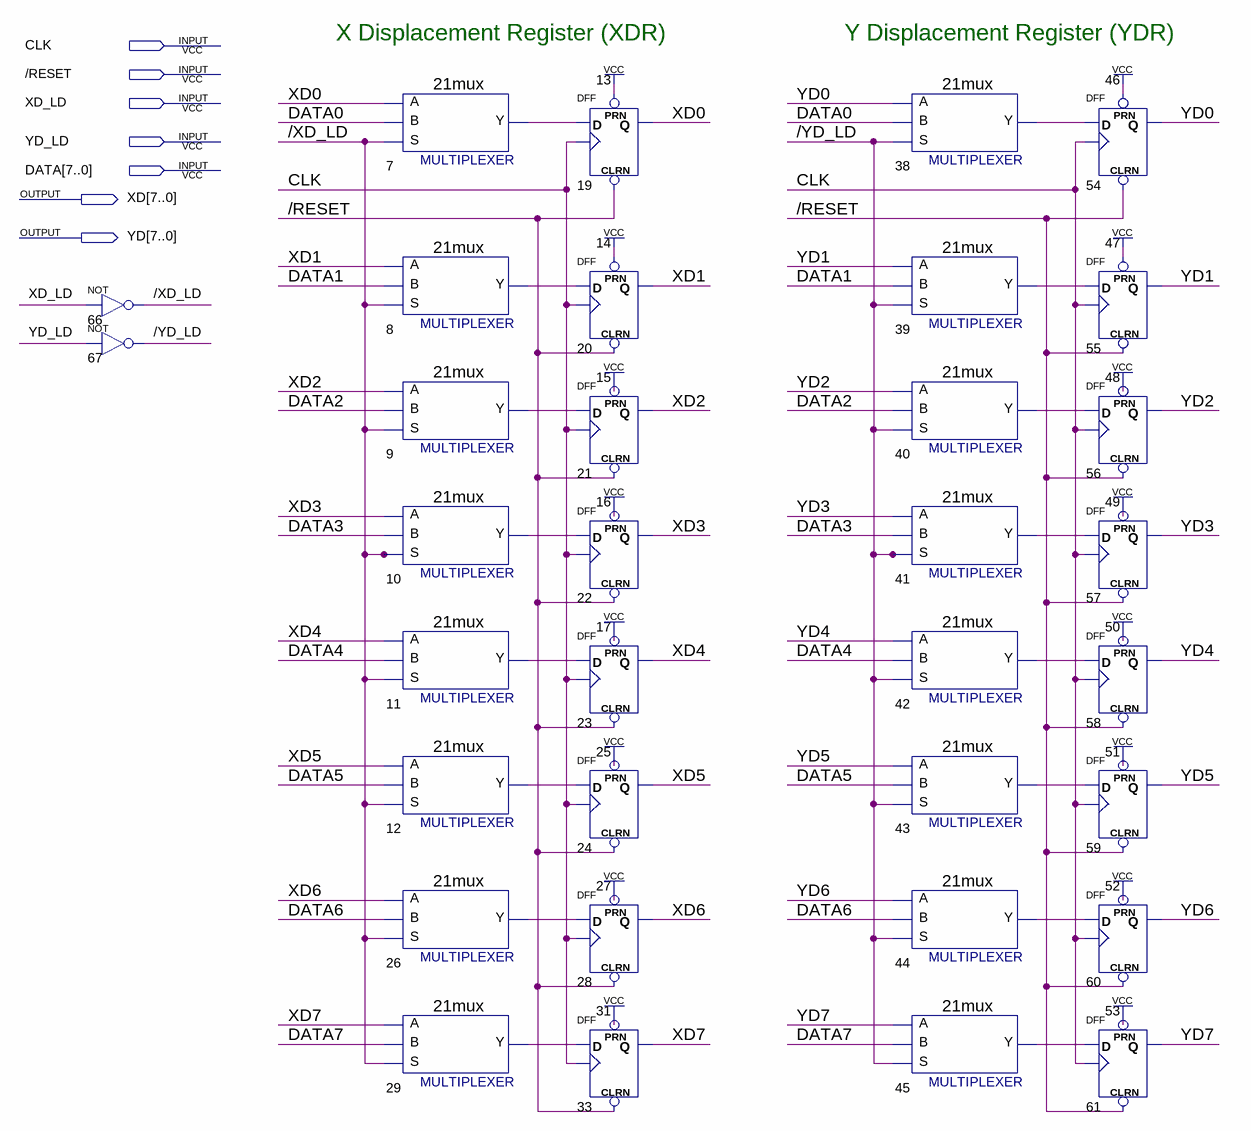
[diagram p0: schematic sheet]
// Quartus schematic xdr_ydr.bdf as structural Verilog: 34 symbols, 7 pins
module xdr_ydr (
  input  CLK,
  input  \/RESET ,
  input  XD_LD,
  input  YD_LD,
  input  [7:0] DATA,
  output [7:0] XD,
  output [7:0] YD
);

  wire \/XD_LD , \/YD_LD , n7_y, n8_y, n9_y, n10_y, n11_y, n12_y, n26_y, n29_y, n38_y, n39_y, n40_y, n41_y,
       n42_y, n43_y, n44_y, n45_y;

  not u_66 (\/XD_LD , XD_LD);
  not u_67 (\/YD_LD , YD_LD);
  \21mux  u_7 (.A(XD[0]), .B(DATA[0]), .S(\/XD_LD ), .Y(n7_y));
  \21mux  u_8 (.A(XD[1]), .B(DATA[1]), .S(\/XD_LD ), .Y(n8_y));
  \21mux  u_9 (.A(XD[2]), .B(DATA[2]), .S(\/XD_LD ), .Y(n9_y));
  \21mux  u_10 (.A(XD[3]), .B(DATA[3]), .S(\/XD_LD ), .Y(n10_y));
  \21mux  u_11 (.A(XD[4]), .B(DATA[4]), .S(\/XD_LD ), .Y(n11_y));
  \21mux  u_12 (.A(XD[5]), .B(DATA[5]), .S(\/XD_LD ), .Y(n12_y));
  \21mux  u_26 (.A(XD[6]), .B(DATA[6]), .S(\/XD_LD ), .Y(n26_y));
  \21mux  u_29 (.A(XD[7]), .B(DATA[7]), .S(\/XD_LD ), .Y(n29_y));
  DFF u_19 (.CLRN(\/RESET ), .CLK(CLK), .D(n7_y), .PRN(1'b1), .Q(XD[0]));
  DFF u_20 (.CLRN(\/RESET ), .CLK(CLK), .D(n8_y), .PRN(1'b1), .Q(XD[1]));
  DFF u_21 (.CLRN(\/RESET ), .CLK(CLK), .D(n9_y), .PRN(1'b1), .Q(XD[2]));
  DFF u_22 (.CLRN(\/RESET ), .CLK(CLK), .D(n10_y), .PRN(1'b1), .Q(XD[3]));
  DFF u_23 (.CLRN(\/RESET ), .CLK(CLK), .D(n11_y), .PRN(1'b1), .Q(XD[4]));
  DFF u_24 (.CLRN(\/RESET ), .CLK(CLK), .D(n12_y), .PRN(1'b1), .Q(XD[5]));
  DFF u_28 (.CLRN(\/RESET ), .CLK(CLK), .D(n26_y), .PRN(1'b1), .Q(XD[6]));
  DFF u_33 (.CLRN(\/RESET ), .CLK(CLK), .D(n29_y), .PRN(1'b1), .Q(XD[7]));
  \21mux  u_38 (.A(YD[0]), .B(DATA[0]), .S(\/YD_LD ), .Y(n38_y));
  \21mux  u_39 (.A(YD[1]), .B(DATA[1]), .S(\/YD_LD ), .Y(n39_y));
  \21mux  u_40 (.A(YD[2]), .B(DATA[2]), .S(\/YD_LD ), .Y(n40_y));
  \21mux  u_41 (.A(YD[3]), .B(DATA[3]), .S(\/YD_LD ), .Y(n41_y));
  \21mux  u_42 (.A(YD[4]), .B(DATA[4]), .S(\/YD_LD ), .Y(n42_y));
  \21mux  u_43 (.A(YD[5]), .B(DATA[5]), .S(\/YD_LD ), .Y(n43_y));
  \21mux  u_44 (.A(YD[6]), .B(DATA[6]), .S(\/YD_LD ), .Y(n44_y));
  \21mux  u_45 (.A(YD[7]), .B(DATA[7]), .S(\/YD_LD ), .Y(n45_y));
  DFF u_54 (.CLRN(\/RESET ), .CLK(CLK), .D(n38_y), .PRN(1'b1), .Q(YD[0]));
  DFF u_55 (.CLRN(\/RESET ), .CLK(CLK), .D(n39_y), .PRN(1'b1), .Q(YD[1]));
  DFF u_56 (.CLRN(\/RESET ), .CLK(CLK), .D(n40_y), .PRN(1'b1), .Q(YD[2]));
  DFF u_57 (.CLRN(\/RESET ), .CLK(CLK), .D(n41_y), .PRN(1'b1), .Q(YD[3]));
  DFF u_58 (.CLRN(\/RESET ), .CLK(CLK), .D(n42_y), .PRN(1'b1), .Q(YD[4]));
  DFF u_59 (.CLRN(\/RESET ), .CLK(CLK), .D(n43_y), .PRN(1'b1), .Q(YD[5]));
  DFF u_60 (.CLRN(\/RESET ), .CLK(CLK), .D(n44_y), .PRN(1'b1), .Q(YD[6]));
  DFF u_61 (.CLRN(\/RESET ), .CLK(CLK), .D(n45_y), .PRN(1'b1), .Q(YD[7]));

  // Notes on the sheet:
  //   X Displacement Register (XDR)
  //   Y Displacement Register (YDR)
endmodule
